# EAGLE schematic Prototipo_2 (EAGLE 6.1)
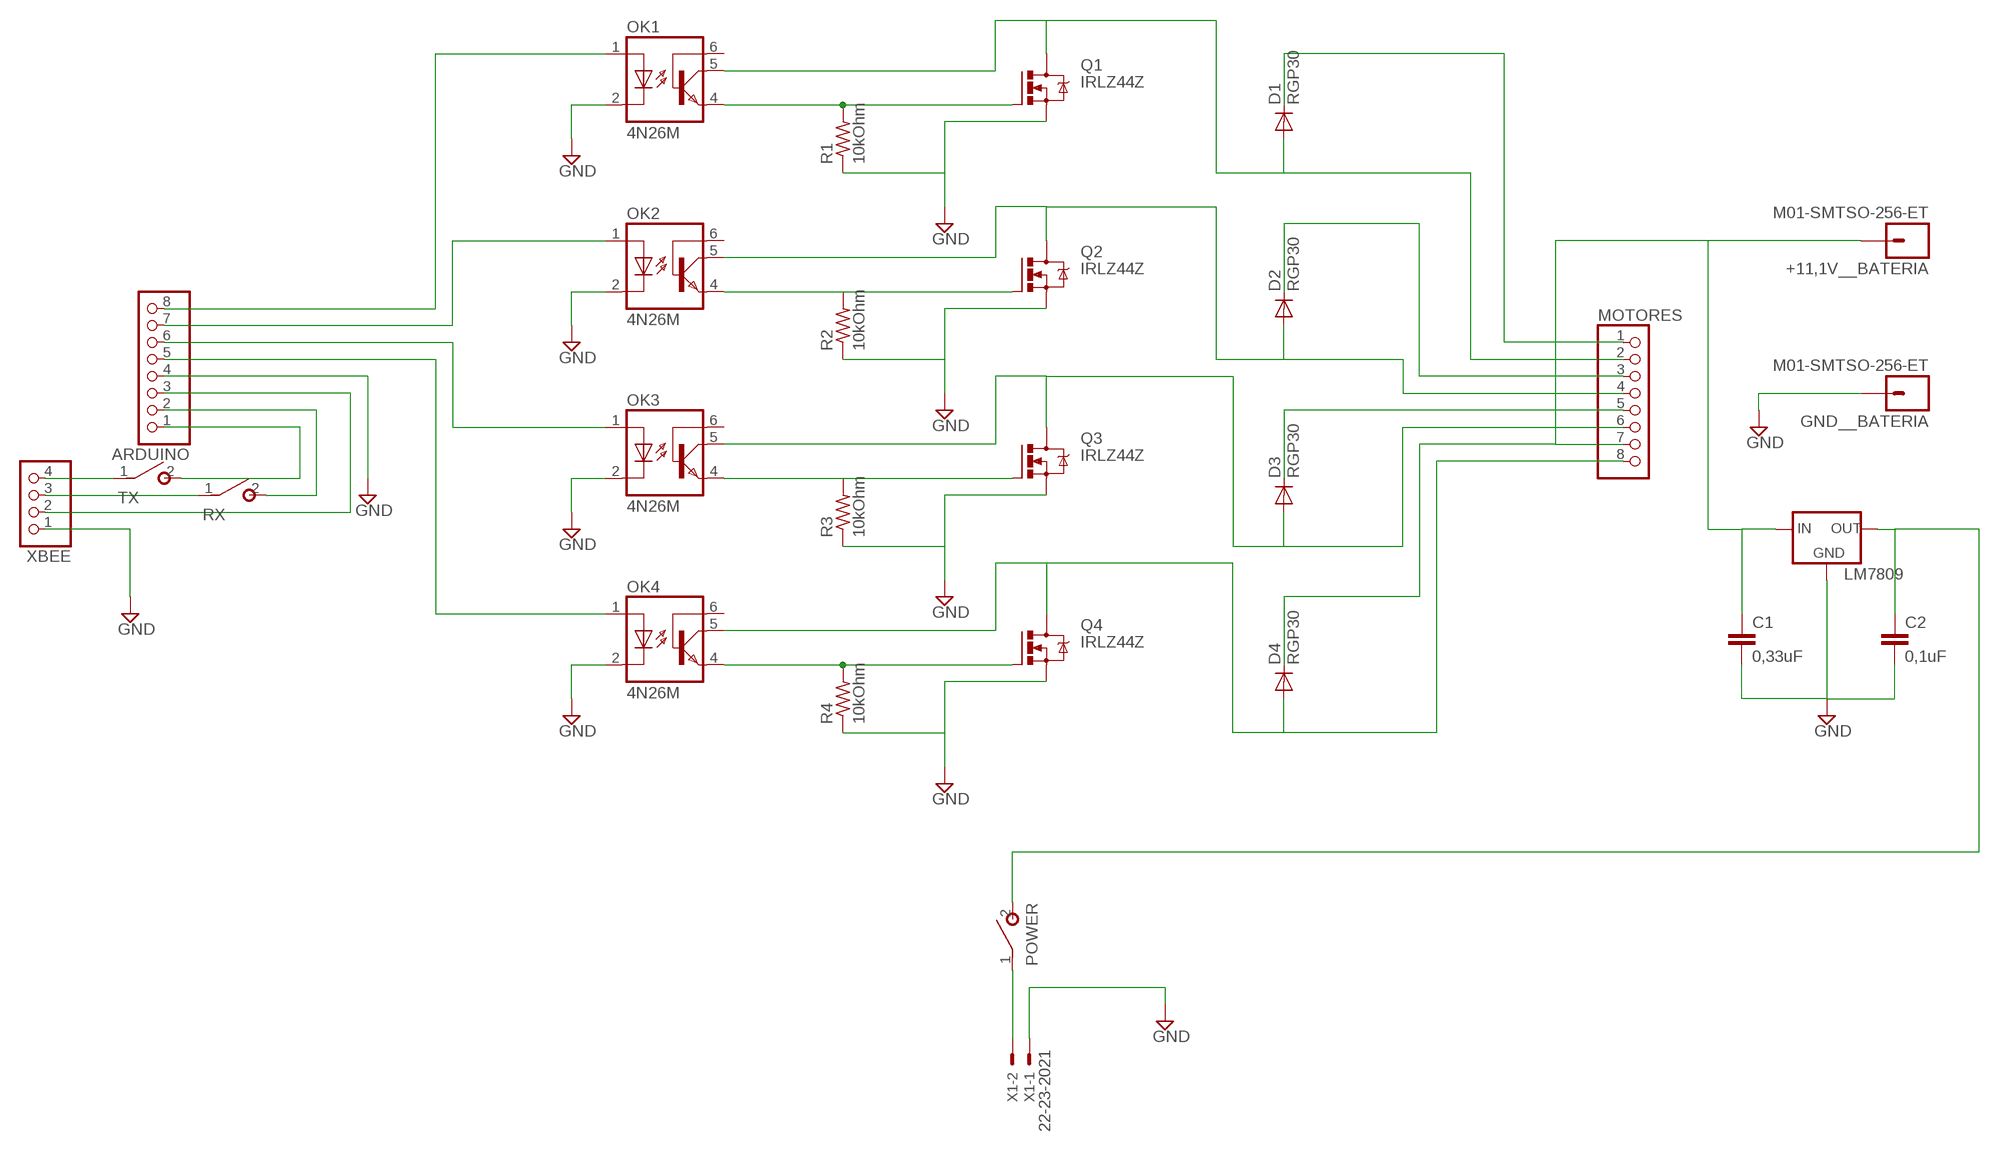
[diagram p0: schematic, sheet 1]

## Parts
+11,1V__BATERIA  M01-SMTSO-256-ET  [SMTSO-256-ET]
ARDUINO  PINHD-1X8/90  [1X08/90]
C1  0,33uF  C-EU050-030X075  [C050-030X075]
C2  0,1uF  C-EU050-030X075  [C050-030X075]
D1  RGP30  [DO201-15]
D2  RGP30  [DO201-15]
D3  RGP30  [DO201-15]
D4  RGP30  [DO201-15]
GND__BATERIA  M01-SMTSO-256-ET  [SMTSO-256-ET]
LM7809  78XXL  [78XXL]
MOTORES  PINHD-1X8/90  [1X08/90]
OK1  4N26M  [DIL06]
OK2  4N26M  [DIL06]
OK3  4N26M  [DIL06]
OK4  4N26M  [DIL06]
POWER  SPST  [SPST]
Q1  IRLZ44Z  [TO220BH]
Q2  IRLZ44Z  [TO220BH]
Q3  IRLZ44Z  [TO220BH]
Q4  IRLZ44Z  [TO220BH]
R1  10kOhm  R-US_0207/7  [0207/7]
R2  10kOhm  R-US_0207/7  [0207/7]
R3  10kOhm  R-US_0207/7  [0207/7]
R4  10kOhm  R-US_0207/7  [0207/7]
RX  SPST  [SPST]
TX  SPST  [SPST]
X1  22-23-2021  [22-23-2021]
XBEE  PINHD-1X4  [1X04]

## Nets
GND: ARDUINO.4 C1.2 C2.2 GND__BATERIA.P$1 LM7809.GND OK1.2(C) OK2.2(C) OK3.2(C) OK4.2(C) Q1.S Q2.S Q3.S Q4.S R1.1 R2.1 R3.1 R4.1 X1.1 XBEE.1
N$1: ARDUINO.8 OK1.1(A)
N$2: ARDUINO.7 OK2.1(A)
N$3: ARDUINO.6 OK3.1(A)
N$4: ARDUINO.5 OK4.1(A)
N$5: TX.1(P) XBEE.4
N$6: C2.1 LM7809.OUT POWER.2(S)
N$7: ARDUINO.1 TX.2(S)
N$8: OK1.4(EMI) Q1.G R1.2
N$9: OK2.4(EMI) Q2.G R2.2
N$10: OK3.4(EMI) Q3.G R3.2
N$11: OK4.4(EMI) Q4.G R4.2
N$12: +11,1V__BATERIA.P$1 C1.1 D1.C D2.C D3.C D4.C LM7809.IN MOTORES.1 MOTORES.3 MOTORES.5 MOTORES.7
N$13: RX.1(P) XBEE.3
N$14: D2.A MOTORES.4 OK2.5(COL) Q2.D
N$15: D3.A MOTORES.6 OK3.5(COL) Q3.D
N$16: D4.A MOTORES.8 OK4.5(COL) Q4.D
N$17: D1.A MOTORES.2 OK1.5(COL) Q1.D
N$18: POWER.1(P) X1.2
N$19: ARDUINO.2 RX.2(S)
N$20: ARDUINO.3 XBEE.2
Unconnected: OK1.6(BAS) OK2.6(BAS) OK3.6(BAS) OK4.6(BAS)

## Library data of the parts
+11,1V__BATERIA GND__BATERIA = SparkFun-Connectors:M01: Header 1 Standard 1-pin 0.1" header. Use with straight break away headers (SKU : PRT-00116), right angle break away headers (PRT-00553), swiss pins (PRT-00743), machine pins (PRT-00117), and female headers (PRT-00115).
ARDUINO MOTORES = pinhead:PINHD-1X8: PIN HEADER
C1 C2 = rcl:C-EU: CAPACITOR, European symbol
D1-D4 = diode:RGP30: DIODE fast-recovery rectifier
LM7809 = v-reg:78XXL: VOLTAGE REGULATOR
OK1-OK4 = optocoupler:4N*?M: General Purpose 6-Pin Phototransistor Optocouplers Source: http://www.fairchildsemi.com/ds/4N/4N35-M.pdf; MPN: 4N26-M; OC_FARNELL: 1021350; OC_NEWARK: 98K9089
POWER RX TX = gm-switches:SPST
Q1-Q4 = transistor-power:IRLZ44Z: N-Channel HEXFET® Power MOSFET Logic Level AUTOMOTIVE MOSFET Source: http://www.irf.com/product-info/datasheets/data/irlz44zpbf.pdf
R1-R4 = rcl:R-US_: RESISTOR, American symbol
X1 = con-molex:22-23-2021: .100" (2.54mm) Center Header - 2 Pin; MF: MOLEX; MPN: 22-23-2021; OC_FARNELL: 1462926; OC_NEWARK: 25C3832
XBEE = pinhead:PINHD-1X4: PIN HEADER